# Altium project esp8266.PrjPCB
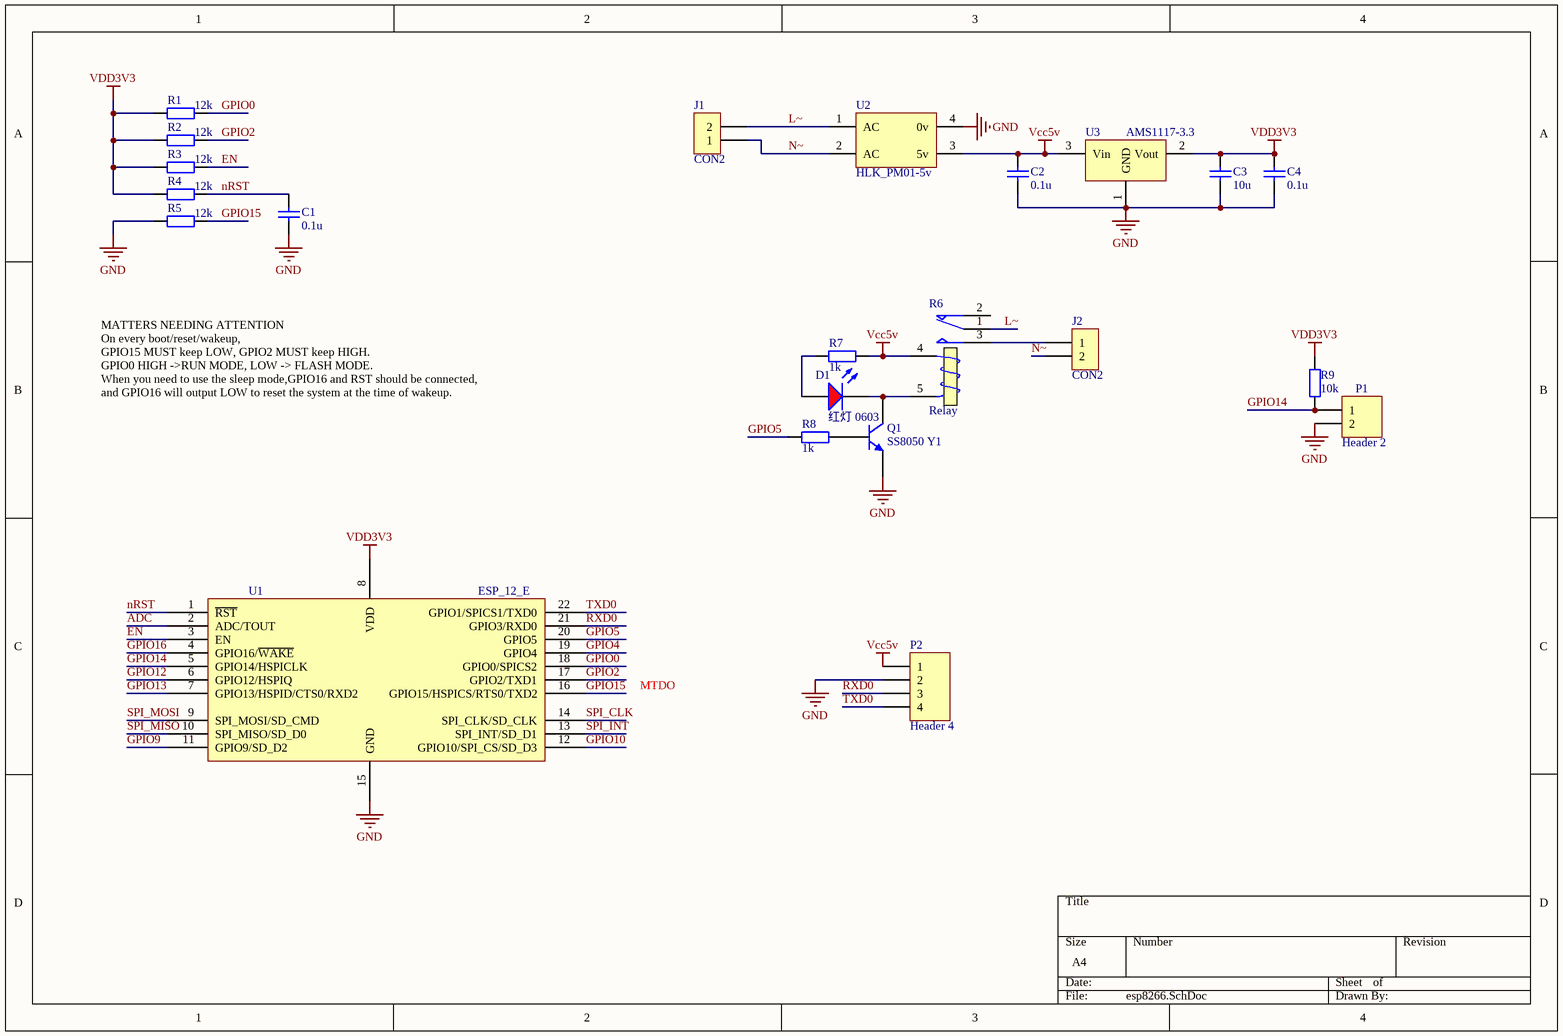
[diagram p0: esp8266.SchDoc]
1 sheet, 22 parts. Net scope: global (net labels, ports and power ports of the same name join across sheets).
Board file: esp8266.PcbDoc

## Sheet esp8266.SchDoc
size A4

### Parts
C1  0.1u  [C0603]
C2  0.1u  [C0603]
C3  10u  [C0603]
C4  0.1u  [C0603]
D1  红灯 0603  [0603_LED_S1]
J1  CON2  [CON_5.08_2]
J2  CON2  [CON_5.08_2]
P1  Header 2  [HDR1X2]
P2  Header 4  [HDR1X4]
Q1  SS8050 Y1  [SOT-23(SOT-23-3)]
R1  12k  [R0603]
R2  12k  [R0603]
R3  12k  [R0603]
R4  12k  [R0603]
R5  12k  [R0603]
R6  Relay  [HF3FF-JQC-3FF-005]
R7  1k  [R0603]
R8  1k  [R0603]
R9  10k  [R0603]
U1  ESP_12_E  [ESP8266]
U2  HLK_PM01-5v  [HLK_PM01-5v]
U3  AMS1117-3.3  [AMS1117]

### Nets
GND: C1.1 C2.1 C3.1 C4.1 P1.2 P2.2 Q1.2(E) R5.1 U1.15(GND) U2.4(0v) U3.1(GND)
Vcc5v: C2.2 P2.1 R6.4(T1) R7.2 U2.3(5v) U3.3(Vin)
VDD3V3: C3.2 C4.2 R1.1 R2.1 R3.1 R4.1 R9.2 U1.8(VDD) U3.2(Vout)
ADC: U1.2(ADC/TOUT)
EN: R3.2 U1.3(EN)
GPIO0: R1.2 U1.18(GPIO0/SPICS2)
GPIO2: R2.2 U1.17(GPIO2/TXD1)
GPIO4: U1.19(GPIO4)
GPIO5: R8.1 U1.20(GPIO5)
GPIO9: U1.11(GPIO9/SD_D2)
GPIO10: U1.12(GPIO10/SPI_CS/SD_D3)
GPIO12: U1.6(GPIO12/HSPIQ)
GPIO13: U1.7(GPIO13/HSPID/CTS0/RXD2)
GPIO14: P1.1 R9.1 U1.5(GPIO14/HSPICLK)
GPIO15: R5.2 U1.16(GPIO15/HSPICS/RTS0/TXD2)
GPIO16: U1.4(GPIO16/~{WAKE})
L~: J1.2 R6.1(COM) U2.1(AC)
nRST: C1.2 R4.2 U1.1(~{RST})
N~: J1.1 J2.2 U2.2(AC)
RXD0: P2.3 U1.21(GPIO3/RXD0)
SPI_CLK: U1.14(SPI_CLK/SD_CLK)
SPI_INT: U1.13(SPI_INT/SD_D1)
SPI_MISO: U1.10(SPI_MISO/SD_D0)
SPI_MOSI: U1.9(SPI_MOSI/SD_CMD)
TXD0: P2.4 U1.22(GPIO1/SPICS1/TXD0)
NetD1_A: D1.A R7.1
NetD1_K: D1.K Q1.3(C) R6.5(T2)
NetJ2_1: J2.1 R6.3(NO)
NetQ1_1: Q1.1(B) R8.2

Not connected (* = marked no-connect by the designer): R6 2(NC)

### Notes on the sheet
- MATTERS NEEDING ATTENTION
  On every boot/reset/wakeup,
  GPIO15 MUST keep LOW, GPIO2 MUST keep HIGH.
  GPIO0 HIGH ->RUN MODE, LOW -> FLASH MODE.
  When you need to use the sleep mode,GPIO16 and RST should be connected,
  and GPIO16 will output LOW to reset the system at the time of wakeup.
- MTDO

### Library data of the parts
C1-C4 = Cap_0402
D1 = 0603 红灯: 发光二极管; ComponentLink1Description: 供应商链接; ComponentLink1URL: http://www.szlcsc.com/product/details_2659.html; Package: 0603; Supplier: LC; SuppliersPartNumber: C2286
J1 J2 = CON2: Connector
P1 = Header 2: Header, 2-Pin; LatestRevisionDate: 17-Jul-2002; LatestRevisionNote: Re-released for DXP Platform.; Publisher: Altium Limited
P2 = Header 4: Header, 4-Pin; LatestRevisionDate: 17-Jul-2002; LatestRevisionNote: Re-released for DXP Platform.; Publisher: Altium Limited
Q1 = SOT-23 SS8050 Y1: 三极管; ComponentLink1Description: 供应商链接; ComponentLink1URL: http://www.szlcsc.com/product/details_2507.html; Package: SOT-23; Supplier: LC; SuppliersPartNumber: C2150
R1-R5 R7-R9 = Res_0402
U1 = ESP_12_E: ESP-12 Wi-Fi Module by AI-Thinker; IC: ESP8266-EX; Vendor: Ai-thinker
U3 = AMS1117